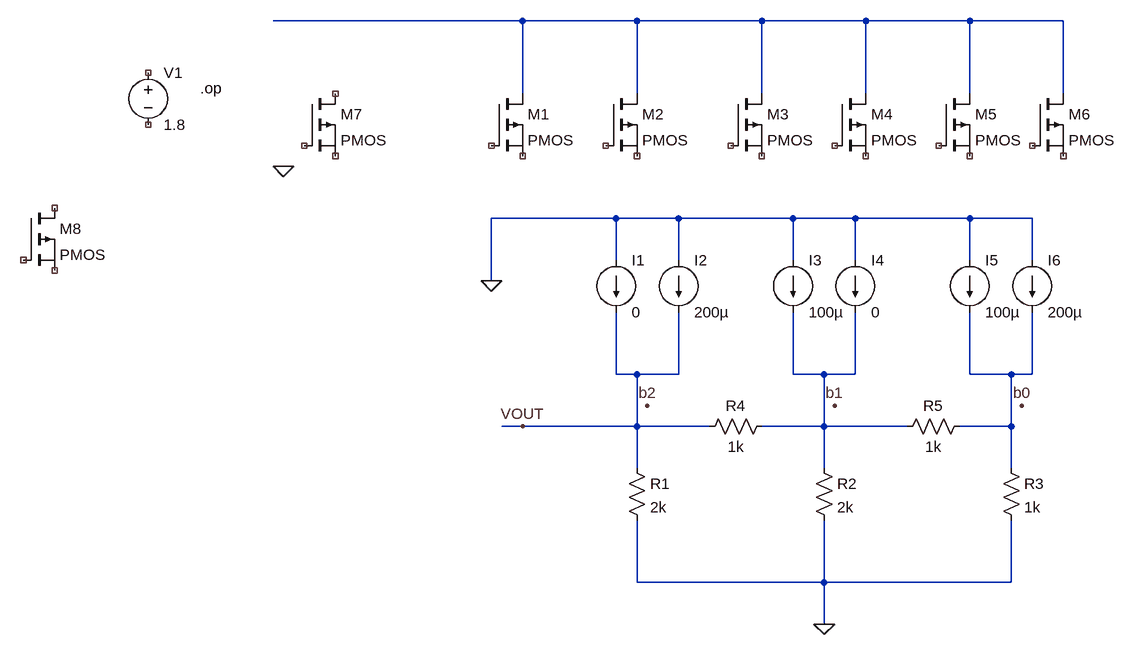
[diagram p0: schematic weighted_r_dac_mirror.asc]
weighted_r_dac_mirror.asc, the LTspice schematic file:
Version 4
SHEET 1 1200 680
WIRE -48 -368 -432 -368
WIRE 128 -368 -48 -368
WIRE 320 -368 128 -368
WIRE 480 -368 320 -368
WIRE 640 -368 480 -368
WIRE 784 -368 640 -368
WIRE -48 -256 -48 -368
WIRE 128 -256 128 -368
WIRE 320 -256 320 -368
WIRE 480 -256 480 -368
WIRE 640 -256 640 -368
WIRE 784 -256 784 -368
WIRE 96 -64 -96 -64
WIRE 192 -64 96 -64
WIRE 368 -64 192 -64
WIRE 464 -64 368 -64
WIRE 640 -64 464 -64
WIRE 736 -64 640 -64
WIRE 96 0 96 -64
WIRE 192 0 192 -64
WIRE 368 0 368 -64
WIRE 464 0 464 -64
WIRE 640 0 640 -64
WIRE 736 0 736 -64
WIRE -96 32 -96 -64
WIRE 96 176 96 80
WIRE 128 176 96 176
WIRE 192 176 192 80
WIRE 192 176 128 176
WIRE 368 176 368 80
WIRE 416 176 368 176
WIRE 464 176 464 80
WIRE 464 176 416 176
WIRE 640 176 640 80
WIRE 704 176 640 176
WIRE 736 176 736 80
WIRE 736 176 704 176
WIRE -48 256 -80 256
WIRE 128 256 128 176
WIRE 128 256 -48 256
WIRE 240 256 128 256
WIRE 416 256 416 176
WIRE 416 256 320 256
WIRE 544 256 416 256
WIRE 704 256 704 176
WIRE 704 256 624 256
WIRE 128 320 128 256
WIRE 416 320 416 256
WIRE 704 320 704 256
WIRE 128 496 128 400
WIRE 416 496 416 400
WIRE 416 496 128 496
WIRE 704 496 704 400
WIRE 704 496 416 496
WIRE 416 560 416 496
FLAG 416 560 0
FLAG -48 256 VOUT
FLAG 144 224 b2
FLAG 432 224 b1
FLAG 720 224 b0
FLAG -96 32 0
FLAG -416 -144 0
SYMBOL res 112 304 R0
SYMATTR InstName R1
SYMATTR Value 2k
SYMBOL res 400 304 R0
SYMATTR InstName R2
SYMATTR Value 2k
SYMBOL res 688 304 R0
SYMATTR InstName R3
SYMATTR Value 1k
SYMBOL res 336 240 R90
WINDOW 0 0 56 VBottom 2
WINDOW 3 32 56 VTop 2
SYMATTR InstName R4
SYMATTR Value 1k
SYMBOL current 96 0 R0
SYMATTR InstName I1
SYMATTR Value 0
SYMBOL current 192 0 R0
SYMATTR InstName I2
SYMATTR Value 200µ
SYMBOL current 368 0 R0
SYMATTR InstName I3
SYMATTR Value 100µ
SYMBOL current 464 0 R0
SYMATTR InstName I4
SYMATTR Value 0
SYMBOL current 640 0 R0
SYMATTR InstName I5
SYMATTR Value 100µ
SYMBOL current 736 0 R0
SYMATTR InstName I6
SYMATTR Value 200µ
SYMBOL res 640 240 R90
WINDOW 0 0 56 VBottom 2
WINDOW 3 32 56 VTop 2
SYMATTR InstName R5
SYMATTR Value 1k
SYMBOL pmos -96 -256 R0
SYMATTR InstName M1
SYMBOL pmos 80 -256 R0
SYMATTR InstName M2
SYMBOL pmos 272 -256 R0
SYMATTR InstName M3
SYMBOL pmos 432 -256 R0
SYMATTR InstName M4
SYMBOL pmos 592 -256 R0
SYMATTR InstName M5
SYMBOL pmos 736 -256 R0
SYMATTR InstName M6
SYMBOL voltage -624 -304 R0
SYMATTR InstName V1
SYMATTR Value 1.8
SYMBOL pmos -384 -256 R0
SYMATTR InstName M7
SYMBOL pmos -816 -80 R0
SYMATTR InstName M8
TEXT -544 -264 Left 2 !.op

The netlist it stands for:
* weighted_r_dac_mirror.asc
R1 VOUT 0 2k
R2 N002 0 2k
R3 N003 0 1k
R4 N002 VOUT 1k
I1 0 VOUT 0
I2 0 VOUT 200µ
I3 0 N002 100µ
I4 0 N002 0
I5 0 N003 100µ
I6 0 N003 200µ
R5 N003 N002 1k
M1 N001 NC_01 NC_02 NC_02 PMOS
M2 N001 NC_03 NC_04 NC_04 PMOS
M3 N001 NC_05 NC_06 NC_06 PMOS
M4 N001 NC_07 NC_08 NC_08 PMOS
M5 N001 NC_09 NC_10 NC_10 PMOS
M6 N001 NC_11 NC_12 NC_12 PMOS
V1 NC_13 NC_14 1.8
M7 NC_15 NC_16 NC_17 NC_17 PMOS
M8 NC_18 NC_19 NC_20 NC_20 PMOS
.model NMOS NMOS
.model PMOS PMOS
.lib standard.mos
.op
.backanno
.end